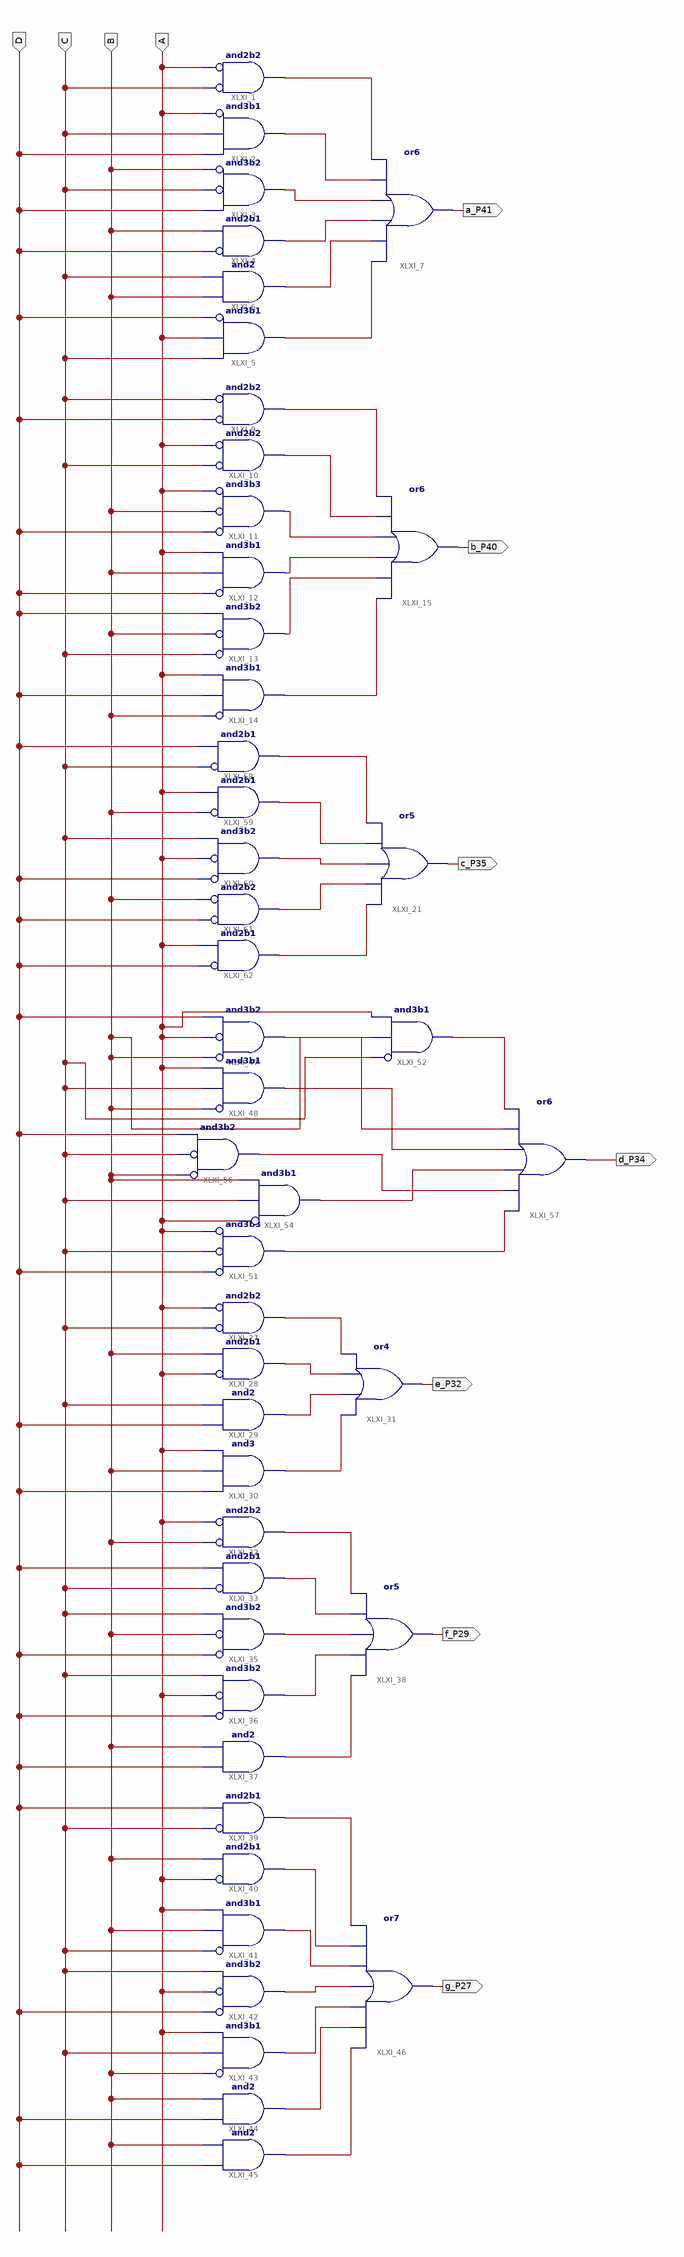
[diagram p0: schematic sheet 1]
// Xilinx ISE schematic Sevenseg.sch (spartan6) as structural Verilog: 46 symbols, 11 ports
module Sevenseg (
  input  D,
  input  C,
  input  B,
  input  A,
  output a_P41,
  output b_P40,
  output c_P35,
  output e_P32,
  output f_P29,
  output g_P27,
  output d_P34
);

  wire XLXN_6, XLXN_7, XLXN_9, XLXN_10, XLXN_11, XLXN_12, XLXN_16, XLXN_17, XLXN_18, XLXN_19, XLXN_20,
       XLXN_21, XLXN_40, XLXN_41, XLXN_42, XLXN_43, XLXN_46, XLXN_47, XLXN_48, XLXN_49, XLXN_50, XLXN_54,
       XLXN_55, XLXN_56, XLXN_57, XLXN_58, XLXN_59, XLXN_60, XLXN_67, XLXN_68, XLXN_69, XLXN_73, XLXN_74,
       XLXN_75, XLXN_79, XLXN_80, XLXN_81, XLXN_82, XLXN_83;

  and XLXI_1 (XLXN_6, ~C, ~A);  // and2b2
  and XLXI_2 (XLXN_7, ~A, C, D);  // and3b1
  and XLXI_3 (XLXN_9, ~B, ~C, D);  // and3b2
  and XLXI_4 (XLXN_10, ~D, B);  // and2b1
  and XLXI_5 (XLXN_12, ~D, A, C);  // and3b1
  and XLXI_6 (XLXN_11, B, C);
  or XLXI_7 (a_P41, XLXN_12, XLXN_11, XLXN_10, XLXN_9, XLXN_7, XLXN_6);
  and XLXI_9 (XLXN_16, ~D, ~C);  // and2b2
  and XLXI_10 (XLXN_17, ~C, ~A);  // and2b2
  and XLXI_11 (XLXN_18, ~D, ~B, ~A);  // and3b3
  and XLXI_12 (XLXN_19, ~D, B, A);  // and3b1
  and XLXI_13 (XLXN_20, ~C, ~B, D);  // and3b2
  and XLXI_14 (XLXN_21, ~B, D, A);  // and3b1
  or XLXI_15 (b_P40, XLXN_21, XLXN_20, XLXN_19, XLXN_18, XLXN_17, XLXN_16);
  or XLXI_21 (c_P35, XLXN_83, XLXN_82, XLXN_81, XLXN_80, XLXN_79);
  and XLXI_27 (XLXN_43, ~C, ~A);  // and2b2
  and XLXI_28 (XLXN_40, ~A, B);  // and2b1
  and XLXI_29 (XLXN_41, D, C);
  and XLXI_30 (XLXN_42, D, B, A);
  or XLXI_31 (e_P32, XLXN_42, XLXN_41, XLXN_40, XLXN_43);
  and XLXI_32 (XLXN_49, ~B, ~A);  // and2b2
  and XLXI_33 (XLXN_48, ~C, D);  // and2b1
  and XLXI_35 (XLXN_46, ~D, ~B, C);  // and3b2
  and XLXI_36 (XLXN_47, ~D, ~A, C);  // and3b2
  and XLXI_37 (XLXN_50, D, B);
  or XLXI_38 (f_P29, XLXN_50, XLXN_47, XLXN_46, XLXN_48, XLXN_49);
  and XLXI_39 (XLXN_54, ~C, D);  // and2b1
  and XLXI_40 (XLXN_55, ~A, B);  // and2b1
  and XLXI_41 (XLXN_56, ~C, B, A);  // and3b1
  and XLXI_42 (XLXN_57, ~D, ~A, C);  // and3b2
  and XLXI_43 (XLXN_58, ~B, C, A);  // and3b1
  and XLXI_44 (XLXN_59, D, B);
  and XLXI_45 (XLXN_60, D, B);
  or XLXI_46 (g_P27, XLXN_60, XLXN_59, XLXN_58, XLXN_57, XLXN_56, XLXN_55, XLXN_54);
  and XLXI_47 (XLXN_68, ~B, ~A, D);  // and3b2
  and XLXI_48 (XLXN_69, ~B, C, A);  // and3b1
  and XLXI_51 (XLXN_73, ~D, ~C, ~A);  // and3b3
  and XLXI_52 (XLXN_67, ~C, B, A);  // and3b1
  and XLXI_54 (XLXN_74, ~A, C, B);  // and3b1
  and XLXI_56 (XLXN_75, ~B, ~C, D);  // and3b2
  or XLXI_57 (d_P34, XLXN_73, XLXN_75, XLXN_74, XLXN_69, XLXN_68, XLXN_67);
  and XLXI_58 (XLXN_79, ~C, D);  // and2b1
  and XLXI_59 (XLXN_80, ~B, A);  // and2b1
  and XLXI_60 (XLXN_81, ~D, ~A, C);  // and3b2
  and XLXI_61 (XLXN_82, ~D, ~B);  // and2b2
  and XLXI_62 (XLXN_83, ~D, A);  // and2b1
endmodule
